# Altium project CAN2UART.PrjPcb
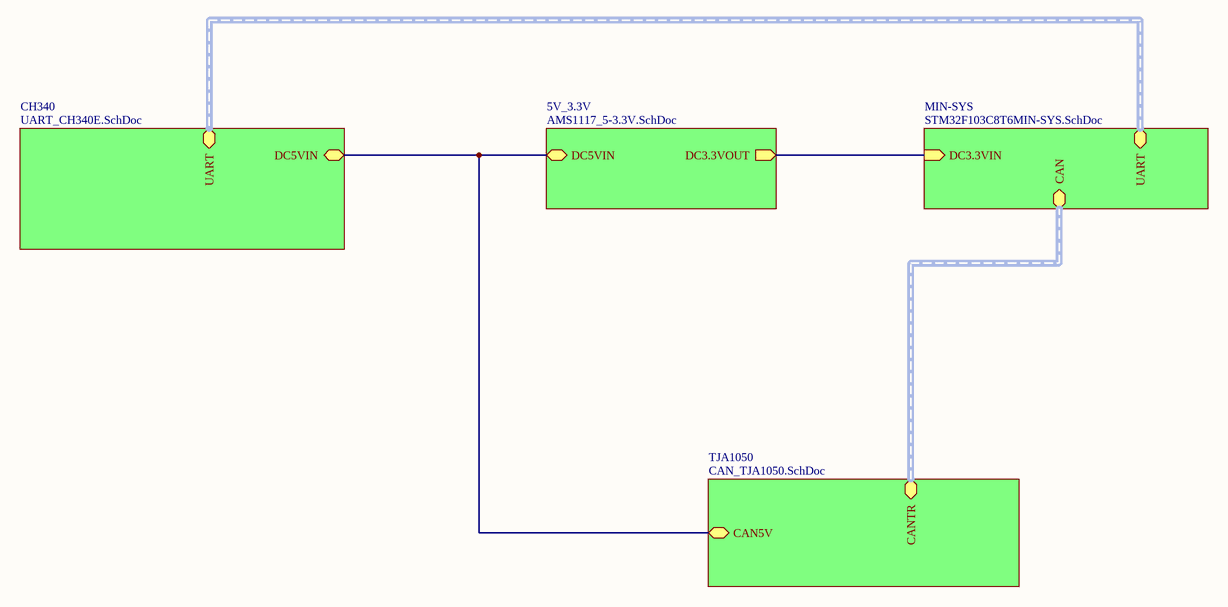
[diagram p0: CAN2UART.SchDoc]
5 sheets, 34 parts. Net scope: hierarchical (ports join the sheet entries above them; power ports are global).
Board file: CAN2UART.PcbDoc
Sheets:
  CAN2UART.SchDoc
    5V_3.3V = AMS1117_5-3.3V.SchDoc
    MIN-SYS = STM32F103C8T6MIN-SYS.SchDoc
    TJA1050 = CAN_TJA1050.SchDoc
    CH340 = UART_CH340E.SchDoc

## Sheet CAN2UART.SchDoc
size A4

### Sub-sheets
5V_3.3V = AMS1117_5-3.3V.SchDoc: DC5VIN, DC3.3VOUT (out)
CH340 = UART_CH340E.SchDoc: DC5VIN, UART (harness UART)
MIN-SYS = STM32F103C8T6MIN-SYS.SchDoc: DC3.3VIN (in), CAN (harness CAN), UART (harness UART)
TJA1050 = CAN_TJA1050.SchDoc: CANTR (harness CAN), CAN5V

### Nets
AMS1117-3.3_3.3VOUT: sheet 5V_3.3V/DC3.3VOUT, sheet MIN-SYS/DC3.3VIN
AMS1117-3.3_5VIN: sheet 5V_3.3V/DC5VIN, sheet TJA1050/CAN5V, sheet CH340/DC5VIN

### Buses and harness runs
harness sheet CH340/UART = sheet MIN-SYS/UART
harness sheet MIN-SYS/CAN = sheet TJA1050/CANTR

## Sheet AMS1117_5-3.3V.SchDoc
size 254 x 127 mm
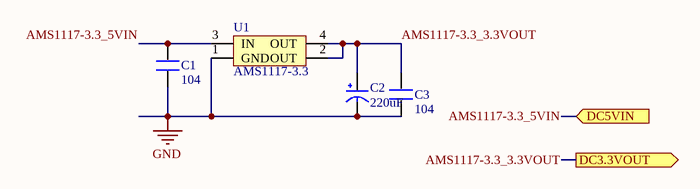
[diagram p1: AMS1117_5-3.3V.SchDoc]

### Parts
C1  104  [0603P]
C2  220uF  [CC6.56.5]
C3  104  [0603P]
U1  AMS1117-3.3  [AMS1117]

### Ports
DC3.3VOUT (out), DC5VIN (in)

### Nets
AMS1117-3.3_3.3VOUT: C2.1(VCC) C3.2 U1.2(OUT) U1.4(OUT) ; port DC3.3VOUT
AMS1117-3.3_5VIN: C1.2 U1.3(IN) ; port DC5VIN
GND: C1.1 C2.2(GND) C3.1 U1.1(GND)

### Library data of the parts
C1 C3 = C
C2 = CAP
U1 = AMS1117

## Sheet STM32F103C8T6MIN-SYS.SchDoc
size A4
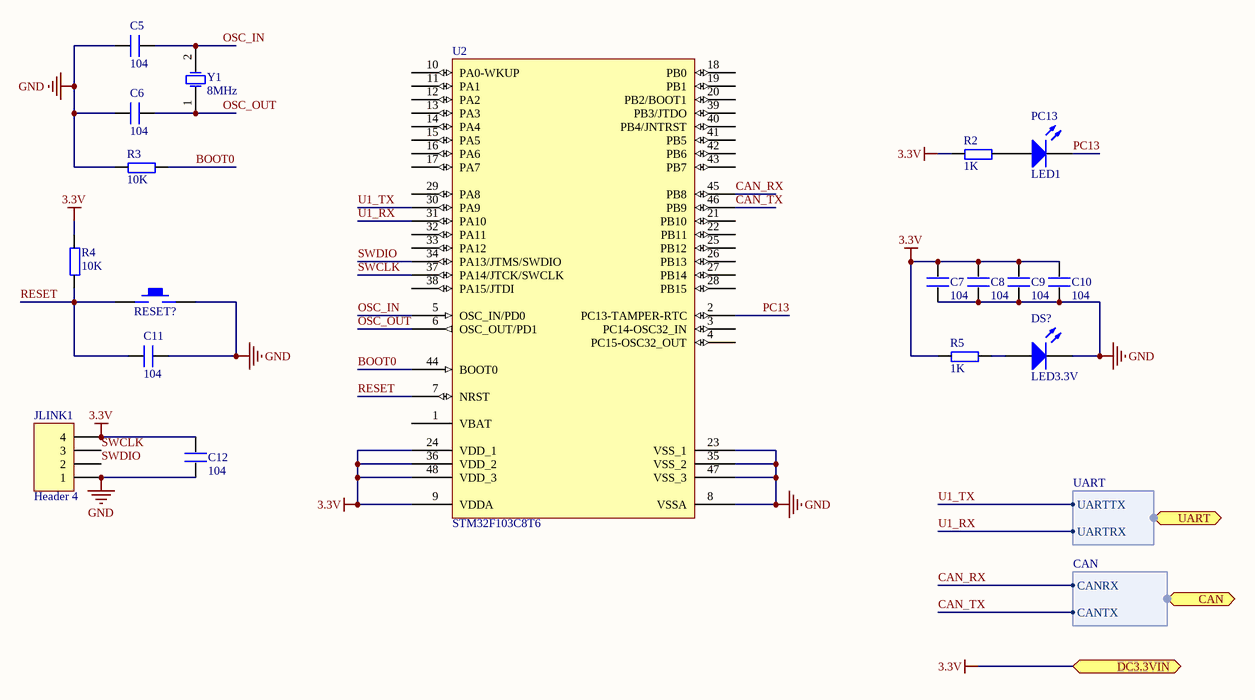
[diagram p2: STM32F103C8T6MIN-SYS.SchDoc]

### Parts
C5  104  [0603P]
C6  104  [0603P]
C7  104  [0603P]
C8  104  [0603P]
C9  104  [0603P]
C10  104  [0603P]
C11  104  [0603P]
C12  104  [0603P]
DS?  LED3.3V  [SMDLED]
JLINK1  Header 4  [HDR1X4]
PC13  LED1  [SMDLED]
R2  1K  [0603P]
R3  10K  [0603P]
R4  10K  [0603P]
R5  1K  [0603P]
RESET  KEY_M  [KEY_M]  (value not drawn)
U2  STM32F103C8T6  [LQFP48_M]
Y1  8MHz  [XTAL_US]

### Ports
CAN (harness CAN), DC3.3VIN, UART (harness UART)

### Harnesses
UART: UARTTX, UARTRX
CAN: CANRX, CANTX

### Nets
3.3V: C7.2 C8.2 C9.2 C10.2 C12.2 JLINK1.4 R2.1 R4.2 R5.1 U2.9(VDDA) U2.24(VDD_1) U2.36(VDD_2) U2.48(VDD_3) ; port DC3.3VIN  [project net AMS1117-3.3_3.3VOUT]
GND: C5.1 C6.1 C7.1 C8.1 C9.1 C10.1 C11.2 C12.1 DS?.2(K) JLINK1.1 R3.1 RESET.2 U2.8(VSSA) U2.23(VSS_1) U2.35(VSS_2) U2.47(VSS_3)
BOOT0: R3.2 U2.44(BOOT0)
CAN_RX: U2.45(PB8) ; port CAN.CANRX
CAN_TX: U2.46(PB9) ; port CAN.CANTX
OSC_IN: C5.2 U2.5(OSC_IN/PD0) Y1.2(OSC2)
OSC_OUT: C6.2 U2.6(OSC_OUT/PD1) Y1.1(OSC1)
PC13: PC13.2(K) U2.2(PC13-TAMPER-RTC)
RESET: C11.1 R4.1 RESET.1 U2.7(NRST)
SWCLK: JLINK1.3 U2.37(PA14/JTCK/SWCLK)
SWDIO: JLINK1.2 U2.34(PA13/JTMS/SWDIO)
U1_RX: U2.31(PA10) ; port UART.UARTRX  [project net CH340E_RXD]
U1_TX: U2.30(PA9) ; port UART.UARTTX  [project net CH340E_TXD]
NetDS?_1: DS?.1(A) R5.2
NetPC13_1: PC13.1(A) R2.2

Not connected (* = marked no-connect by the designer): U2 1(VBAT) 3(PC14-OSC32_IN) 4(PC15-OSC32_OUT) 10(PA0-WKUP) 11(PA1) 12(PA2) 13(PA3) 14(PA4) 15(PA5) 16(PA6) 17(PA7) 18(PB0) 19(PB1) 20(PB2/BOOT1) 21(PB10) 22(PB11) 25(PB12) 26(PB13) 27(PB14) 28(PB15) 29(PA8) 32(PA11) 33(PA12) 38(PA15/JTDI) 39(PB3/JTDO) 40(PB4/JNTRST) 41(PB5) 42(PB6) 43(PB7)

### Library data of the parts
C5-C12 = C
DS? PC13 = LED2: Typical RED, GREEN, YELLOW, AMBER GaAs LED; Published: 8-Jun-2000; LatestRevisionDate: 17-Jul-2002; LatestRevisionNote: Re-released for DXP Platform.; PackageDocument: Feb-2002; PackageReference: 3.2X1.6X1.1; Publisher: Altium Limited
JLINK1 = Header 4: Header, 4-Pin; LatestRevisionDate: 17-Jul-2002; LatestRevisionNote: Re-released for DXP Platform.; Publisher: Altium Limited
R2-R5 = R
U2 = STM32F103C8T6: STM32 ARM-based 32-bit MCU with 64 Kbytes Flash, 48-pin LQFP, Industrial Temperature; Published: 30-May-2008; DatasheetVersion: rev6, Mar-2008; PackageVersion: Mar-2008; PackageReference: LQFP48; Publisher: Altium Limited; PackageDescription: 48-Pin Low-Profile Quad Flat Pack, 7 x 7 mm Body, 0.5 mm Pitch (LQFP48); ComponentLink1Description: Manufacturer Link; ComponentLink1URL: www.st.com/stm32; ComponentLink2Description: Datasheet; ComponentLink2URL: http://www.st.com/stonline/products/literature/ds/13587.pdf
Y1 = XTAL: Crystal Oscillator; Published: 8-Jun-2000; LatestRevisionDate: 17-Jul-2002; LatestRevisionNote: Re-released for DXP Platform.; Publisher: Altium Limited

## Sheet CAN_TJA1050.SchDoc
size A4
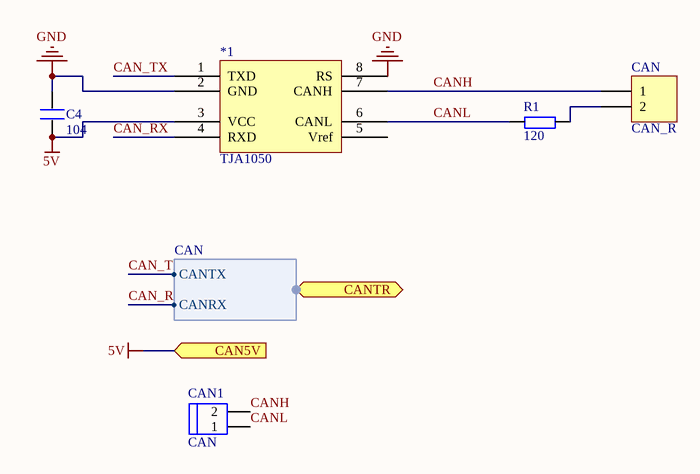
[diagram p3: CAN_TJA1050.SchDoc]

### Parts
*1  TJA1050  [SOP8]
C4  104  [0603P]
CAN  CAN_R  [HDR1X2]
CAN1  CAN  [HEAD2L-0.8]
R1  120  [0603P]

### Ports
CAN5V (in), CANTR (harness CAN)

### Harnesses
CAN: CANTX, CANRX

### Nets
5V: *1.3(VCC) C4.1 ; port CAN5V  [project net AMS1117-3.3_5VIN]
GND: *1.2(GND) *1.8(RS) C4.2
CAN_RX: *1.4(RXD) ; port CANTR.CANRX
CAN_TX: *1.1(TXD) ; port CANTR.CANTX
CANH: *1.7(CANH) CAN.1 CAN1.2
CANL: *1.6(CANL) CAN1.1 R1.1
NetCAN_2: CAN.2 R1.2

Not connected (* = marked no-connect by the designer): *1 5(Vref)

### Library data of the parts
C4 = C
CAN = Header 2: Header, 2-Pin; LatestRevisionDate: 17-Jul-2002; LatestRevisionNote: Re-released for DXP Platform.; Publisher: Altium Limited
CAN1 = HEAD2
R1 = R

## Sheet UART_CH340E.SchDoc
size A4
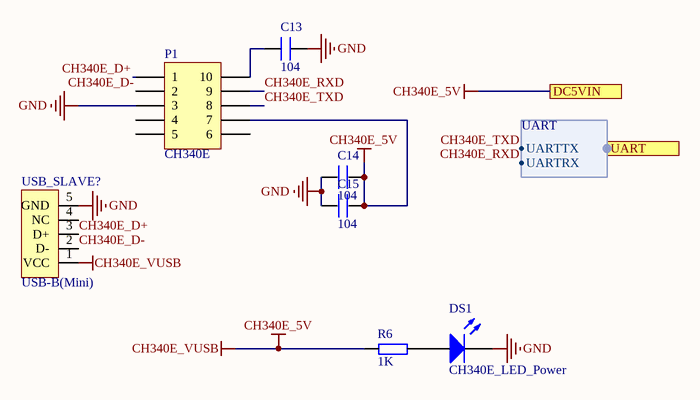
[diagram p4: UART_CH340E.SchDoc]

### Parts
C13  104  [0603P]
C14  104  [0603P]
C15  104  [0603P]
DS1  CH340E_LED_Power  [SMDLED-0603]
P1  CH340E  [SOP10]
R6  1K  [0603P]
USB_SLAVE?  USB-B(Mini)  [MICRO-USB]

### Ports
DC5VIN, UART (harness UART)

### Harnesses
UART: UARTTX, UARTRX

### Nets
CH340E_5V: C14.2 C15.2 P1.7 R6.1 USB_SLAVE?.1(VCC) ; port DC5VIN  [also labelled CH340E_VUSB]  [project net AMS1117-3.3_5VIN]
GND: C13.2 C14.1 C15.1 DS1.2(K) P1.3 USB_SLAVE?.5(GND)
CH340E_D+: P1.1 USB_SLAVE?.3(D+)
CH340E_D-: P1.2 USB_SLAVE?.2(D-)
CH340E_RXD: P1.9 ; port UART.UARTRX
CH340E_TXD: P1.8 ; port UART.UARTTX
NetC13_1: C13.1 P1.10
NetDS1_1: DS1.1(A) R6.2

Not connected (* = marked no-connect by the designer): P1 4 5 6; USB_SLAVE? 4(NC)

### Library data of the parts
C13-C15 = C
DS1 = LED2: as DS? on sheet STM32F103C8T6MIN-SYS; Published: 8-Jun-2000; LatestRevisionDate: 17-Jul-2002; LatestRevisionNote: Re-released for DXP Platform.; PackageDocument: Feb-2002; PackageReference: 3.2X1.6X1.1; Publisher: Altium Limited
P1 = Header 5X2A: Header, 5-Pin, Dual row; LatestRevisionDate: 17-Jul-2002; LatestRevisionNote: Re-released for DXP Platform.; Publisher: Altium Limited
R6 = R
USB_SLAVE? = USB5

## Nets that join several sheets
AMS1117-3.3_3.3VOUT: AMS1117_5-3.3V (C2.1 C3.2 U1.2 U1.4), STM32F103C8T6MIN-SYS (13 pins)
AMS1117-3.3_5VIN: AMS1117_5-3.3V (C1.2 U1.3), CAN_TJA1050 (*1.3 C4.1), UART_CH340E (5 pins)
GND: AMS1117_5-3.3V (C1.1 C2.2 C3.1 U1.1), STM32F103C8T6MIN-SYS (16 pins), CAN_TJA1050 (*1.2 *1.8 C4.2), UART_CH340E (6 pins)
CAN_RX: STM32F103C8T6MIN-SYS (U2.45), CAN_TJA1050 (*1.4)
CAN_TX: STM32F103C8T6MIN-SYS (U2.46), CAN_TJA1050 (*1.1)
CH340E_RXD: STM32F103C8T6MIN-SYS (U2.31), UART_CH340E (P1.9)
CH340E_TXD: STM32F103C8T6MIN-SYS (U2.30), UART_CH340E (P1.8)